# EAGLE design meter-stick-reva (EAGLE 6.5.0)
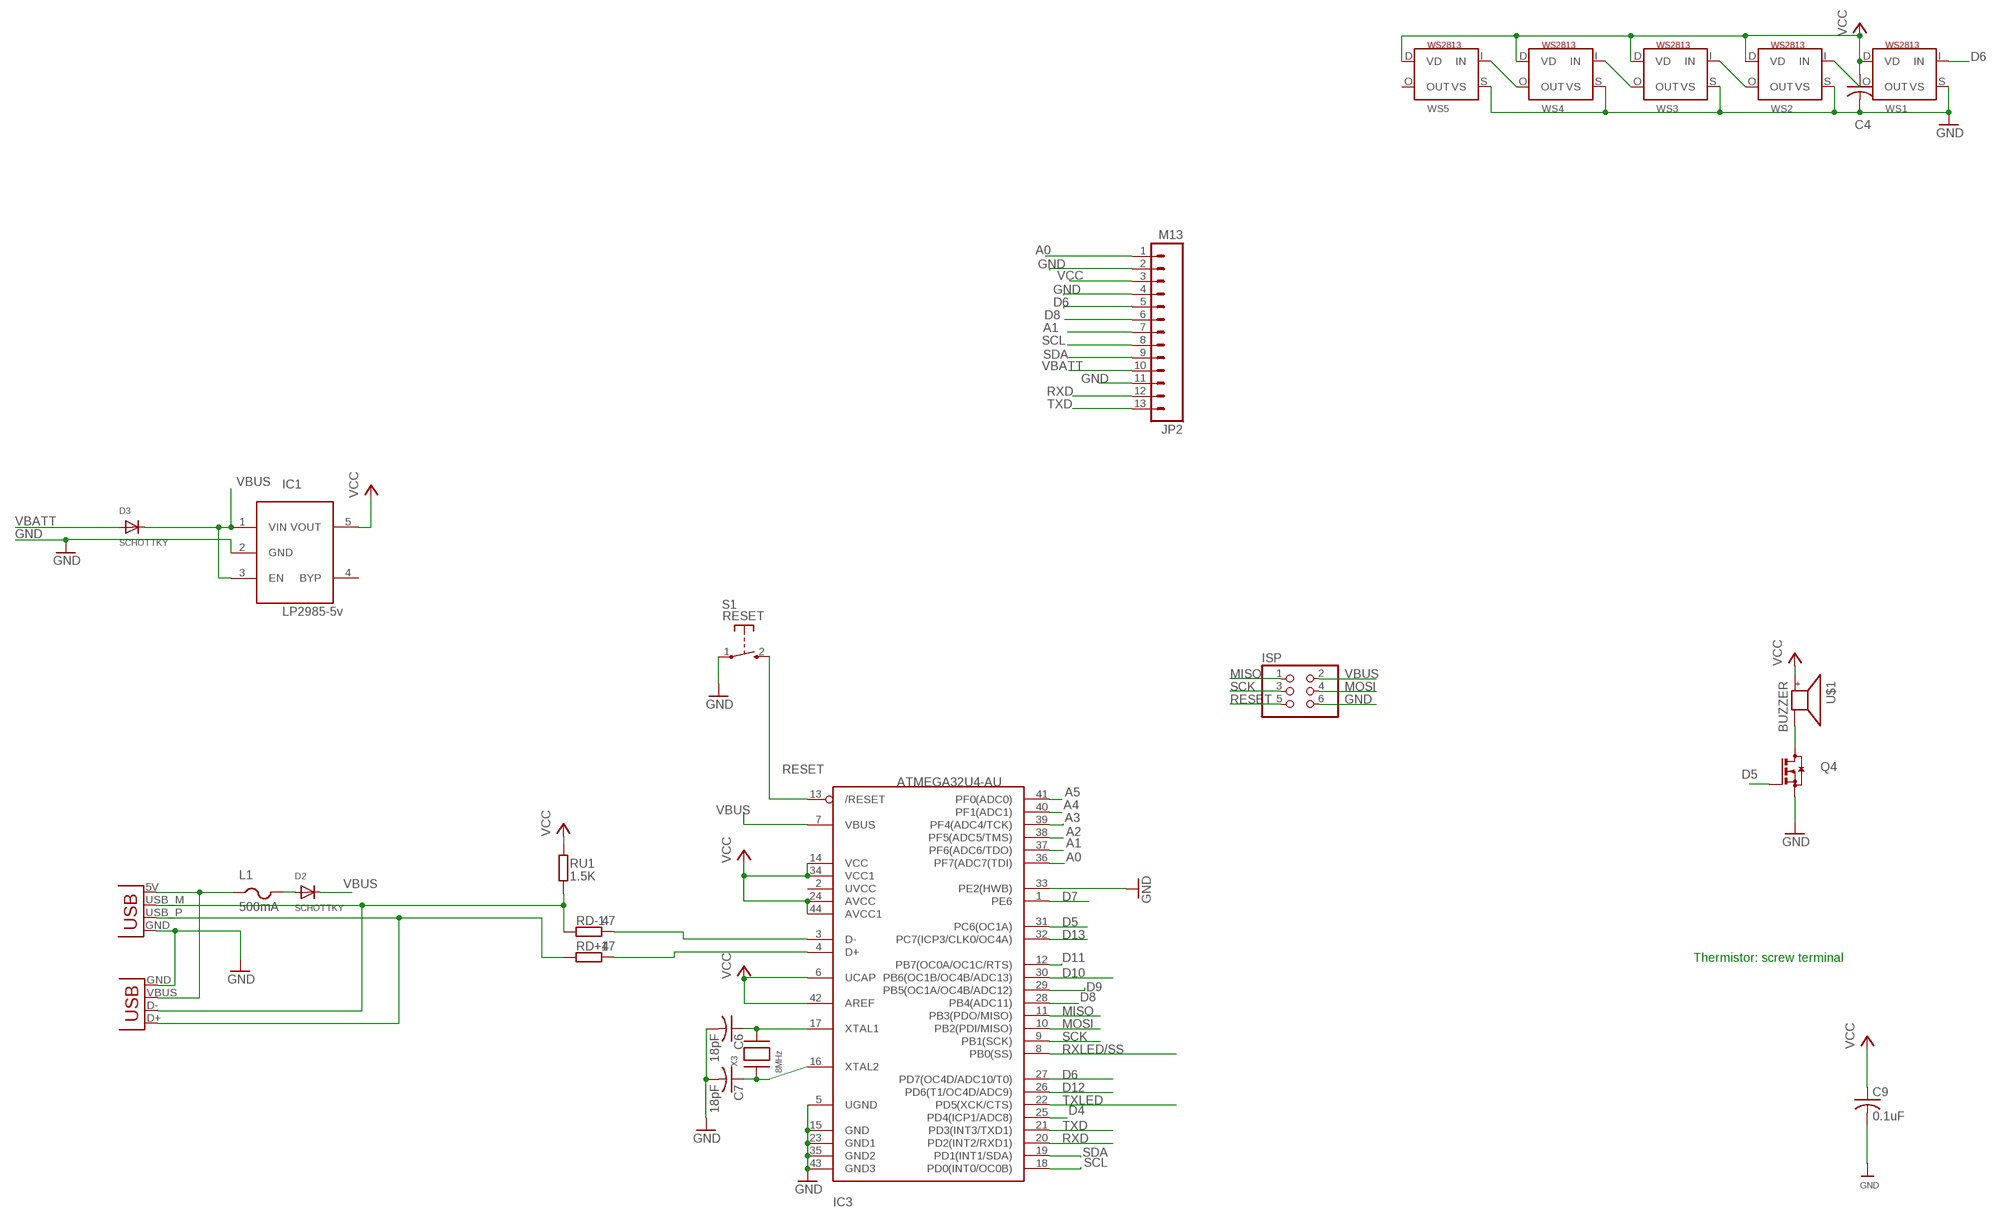
[diagram p0: schematic, sheet 1]

## Parts
C4  C-USC0805K  [C0805K]
C6  18pF  C-USC0805K  [C0805K]
C7  18pF  C-USC0805K  [C0805K]
C9  0.1uF  C-USC0805  [C0805]
D2  SCHOTTKY  DIODESOD-123  [SOD-123]
D3  SCHOTTKY  DIODESOD-123  [SOD-123]
IC1  LP2985-5v  LP298XS  [SOT23-5L]
IC3  ATMEGA32U4-AU  [TQFP44]
ISP  PINHD-2X3  [2X03]
JP2  M13  [1X13]
L1  500mA  PTCFUSE-1206  [R1206]
P1  USBPCB  [USB-A-PCB]
Q4  BSS123  [SOT23]
RD+1  47  R-EU_R0805  [R0805]
RD-1  47  R-EU_R0805  [R0805]
RU1  1.5K  R-EU_R0805  [R0805]
S1  RESET  TAC_SWITCH_2PIN  [TACTILE_SWITCH_SMD_2PIN_TINY]
U$1  BUZZER  [SMT-8585-BUZZER]
WS1  WS2813  [RGBLED5050_4]
WS2  WS2813  [RGBLED5050_4]
WS3  WS2813  [RGBLED5050_4]
WS4  WS2813  [RGBLED5050_4]
WS5  WS2813  [RGBLED5050_4]
X2  USBSMD  [USB-MINIB]
X3  8MHz  XTALNX5032  [NX5032]

## Nets
A0: IC3.36(PF7(ADC7(TDI)) JP2.1
A1: IC3.37(PF6(ADC6/TDO)) JP2.7
A2: IC3.38(PF5(ADC5/TMS))
A3: IC3.39(PF4(ADC4/TCK))
A4: IC3.40(PF1(ADC1))
A5: IC3.41(PF0(ADC0))
D4: IC3.25(PD4(ICP1/ADC8))
D5: IC3.31(PC6(OC1A)) Q4.1(G)
D6: IC3.27(PD7(OC4D/ADC10/T0)) JP2.5 WS1.I(IN)
D7: IC3.1(PE6)
D8: IC3.28(PB4(ADC11)) JP2.6
D9: IC3.29(PB5(OC1A/OC4B/ADC12))
D10: IC3.30(PB6(OC1B/OC4B/ADC13))
D11: IC3.12(PB7(OC0A/OC1C/RTS))
D12: IC3.26(PD6(T1/OC4D/ADC9))
D13: IC3.32(PC7(ICP3/CLK0/OC4A))
D-: P1.USB_M(D-) RD-1.1 RU1.1 X2.D-
GND: C4.2 C6.2 C7.2 C9.2 IC1.2(GND) IC3.5(UGND) IC3.15(GND) IC3.23(GND1) IC3.33(PE2(HWB)) IC3.35(GND2) IC3.43(GND3) ISP.6 JP2.2 JP2.4 JP2.11 P1.GND Q4.2(S) S1.1(P) WS1.S(VS) WS2.S(VS) WS3.S(VS) WS4.S(VS) WS5.S(VS) X2.GND
MISO: IC3.11(PB3(PDO/MISO)) ISP.1
MOSI: IC3.10(PB2(PDI/MISO)) ISP.4
N$1: D2.A L1.2
N$2: C7.1 IC3.16(XTAL2) X3.P$1
N$3: C6.1 IC3.17(XTAL1) X3.P$2
N$4: P1.USB_P(D+) RD+1.1 X2.D+
N$7: Q4.3(D) U$1.-
N$19: WS4.O(OUT) WS5.I(IN)
N$21: IC3.4(D+) RD+1.2
N$22: IC3.3(D-) RD-1.2
N$23: WS1.O(OUT) WS2.I(IN)
N$24: WS2.O(OUT) WS3.I(IN)
N$25: WS3.O(OUT) WS4.I(IN)
RESET: IC3.13(/RESET) ISP.5 S1.2(S)
RXD: IC3.20(PD2(INT2/RXD1)) JP2.12
RXLED/SS: IC3.8(PB0(SS))
SCK: IC3.9(PB1(SCK)) ISP.3
SCL: IC3.18(PD0(INT0/OC0B)) JP2.8
SDA: IC3.19(PD1(INT1/SDA)) JP2.9
TXD: IC3.21(PD3(INT3/TXD1)) JP2.13
TXLED: IC3.22(PD5(XCK/CTS))
VBATT: D3.A JP2.10
VBUS: D2.C D3.C IC1.1(VIN) IC1.3(EN) IC3.7(VBUS) ISP.2
VBUS1: L1.1 P1.5V(VBUS) X2.VBUS
VCC: C4.1 C9.1 IC1.5(VOUT) IC3.6(UCAP) IC3.14(VCC) IC3.24(AVCC) IC3.34(VCC1) IC3.42(AREF) IC3.44(AVCC1) JP2.3 RU1.2 U$1.+ WS1.D(VD) WS2.D(VD) WS3.D(VD) WS4.D(VD) WS5.D(VD)
Unconnected: IC1.4(BYP) IC3.2(UVCC) WS5.O(OUT)

## Notes on the sheet
- Thermistor: screw terminal

## Library data of the parts
C4 = adafruit2013:C-US: CAPACITOR, American symbol
C6 C7 C9 = adafruit:C-US: CAPACITOR, American symbol
D2 D3 = adafruit:DIODE: Diode SMADIODE - SMA Surface Mount Package 20V 1A Schottky Diode Digikey: 641-1014-6-ND DO-1N4148 - Through Hole Small Current Diode SOD-123 20V 1 A (.5mV Vf) Schottky Diode - Digikey: MBRX120TPMSCT-ND SOD-323 10V 570mA (.38mV Vf, 3ns) Schottky Diode - Digikey: ZLLS410CT-ND SOD-523 30V 30mA Schottky Diode (RB751S-40TE61) - Digikey: RB751S-40TE61CT-ND SOT23-R/W - SOT23 Package (R = Solder Paste/Reflow Ovens, W = Hand-Soldering) BAT54Film 40V 300mA - Digikey: 497-7162-1-ND
IC1 = adafruit:LP298X
IC3 = adaprog:ATMEGA32U4
ISP = pinhead:PINHD-2X3: PIN HEADER
JP2 = SparkFun-Connectors:M13: 13-pin single row .1" header
L1 = adafruit:PTCFUSE: PTC fuses, resettable thermistors
P1 = freetronics-master-v1:USB: USB Connectors USB-B-PTH is fully proven SKU : PRT-00139 USB-miniB is fully proven SKU : PRT-00587 USB-A-PCB is untested. USB-A-H is throughly reviewed, but untested. Spark Fun Electronics SKU : PRT-00437 USB-B-SMT is throughly reviewed, but untested. Needs silkscreen touching up. USB-A-S has not been used/tested USB-MB-H has not been used/tested
Q4 = transistor-small-signal:BSS123: N-CHANNEL MOS FET
RD+1 RD-1 RU1 = rcl:R-EU_: RESISTOR, European symbol
S1 = freetronics-master-v1:TAC_SWITCH_2PIN: Momentary Tactile Switch - 2 pin
U$1 = adafruit:BUZZER
WS1-WS5 = adafruit:WS2813
X2 = SparkFun:USB: USB Connectors USB-B-PTH is fully proven SKU : PRT-00139 USB-miniB is fully proven SKU : PRT-00587 USB-A-PCB is untested. USB-A-H is throughly reviewed, but untested. Spark Fun Electronics SKU : PRT-00437 USB-B-SMT is throughly reviewed, but untested. Needs silkscreen touching up. USB-A-S has not been used/tested USB-MB-H has not been used/tested
X3 = adaprog:XTAL

## Net classes
0 default: width 0.152 mm, drill 0.241 mm, clearance 0.152 mm
1 power: width 0.813 mm, clearance 0.203 mm

## Board
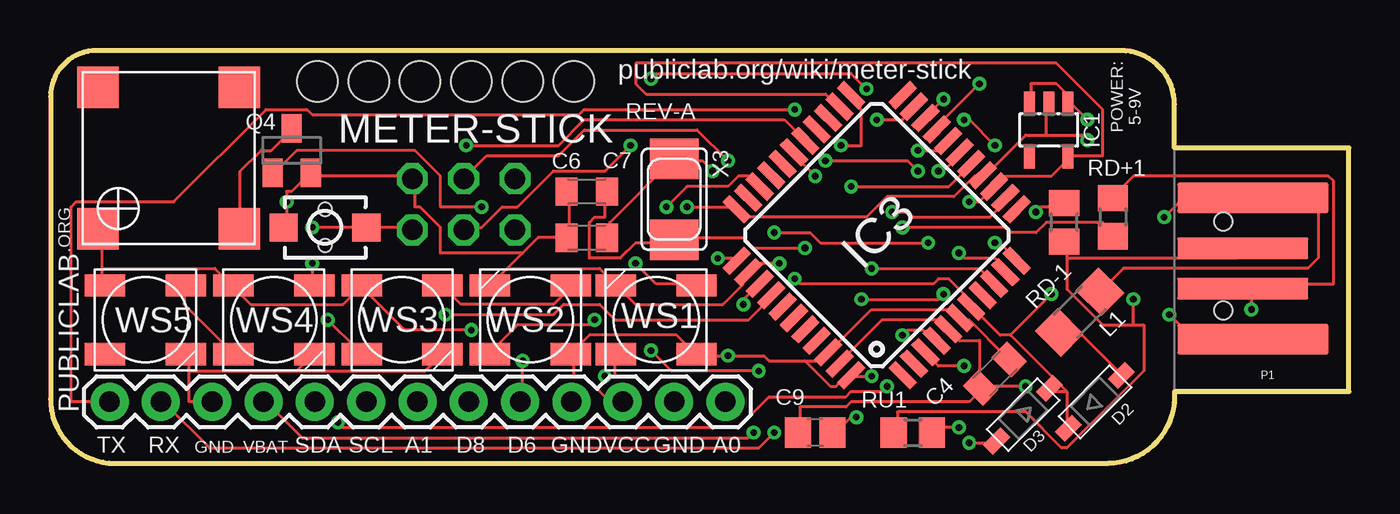
[diagram p1: board, top side]
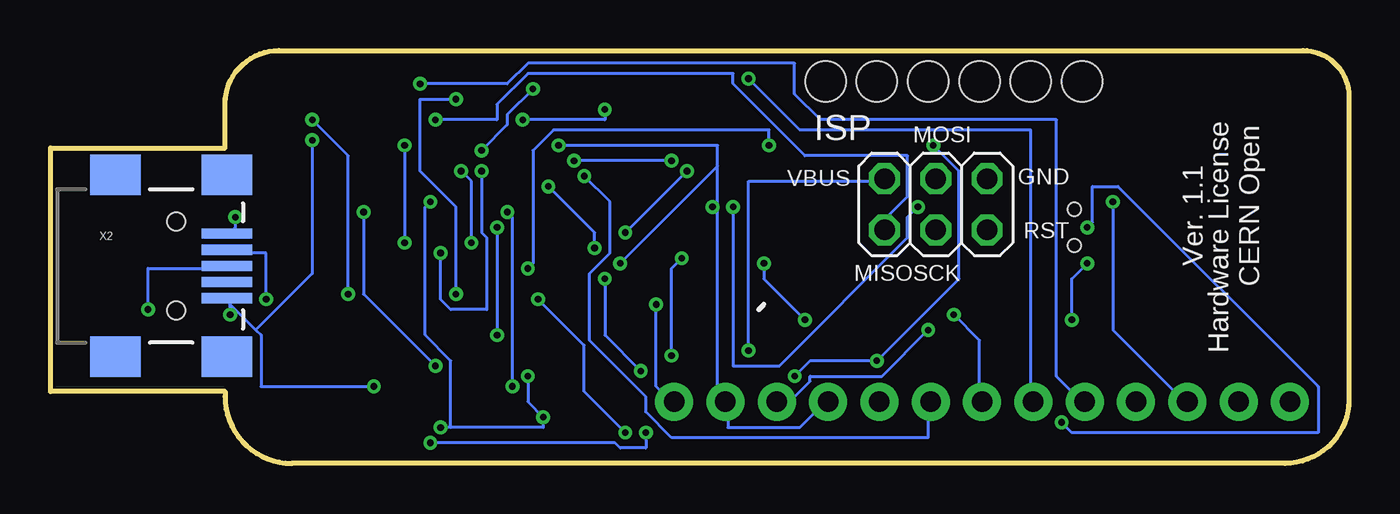
[diagram p2: board, bottom side, seen from below]

Size 64.26 x 20.45 mm. Coordinates in mm from the lower left corner, seen from the top.
Outline: 64.26,15.62 55.63,15.62 55.63,17.78 arc90 52.96,20.45 2.29,20.45 arc90 0,18.16 0,3.17 arc90 3.17,0 52.32,0 arc90 55.63,3.3 55.63,3.56 64.26,3.56 64.26,15.62
Copper layers (1*16): Top 0.0356mm / dielectric 1.5011mm / Bottom 0.0356mm
Design rules "LaenPCBOrder": minimum track width 6mil, minimum drill 13mil, track to track 6mil, track to pad 6mil, pad to pad 6mil, via to via 6mil, smd to smd 6mil, copper to edge 15mil, drill to drill 6mil, minimum pad ring 7mil, minimum via ring 7mil, stop-mask expansion 3mil, vias tented up to drill 0mil, thermal gap 10mil
Holes 2 mm at 13.21,18.92 15.75,18.92 18.29,18.92 20.83,18.92 23.37,18.92 25.91,18.92

### Footprints (pad centres in the part's own frame; a part is rotated, then mirrored left to right if it is on the bottom)
C0805K = smd 1.1 x 1.4: 1 -1,0; 2 1,0
C0805 = smd 1.3 x 1.5: 1 -0.85,0; 2 0.85,0
SOD-123 = smd 1.2 x 0.7: A 1.85,0; C -1.85,0
SOT23-5L = smd 0.55 x 1.2: 1 -0.95,-1.3; 2 0,-1.3; 3 0.95,-1.3; 4 0.95,1.3; 5 -0.95,1.3
TQFP44 = smd 1.5 x 0.5: 1 -5.8,4; 2 -5.8,3.2; 3 -5.8,2.4; 4 -5.8,1.6; 5 -5.8,0.8; 6 -5.8,0; 7 -5.8,-0.8; 8 -5.8,-1.6; 9 -5.8,-2.4; 10 -5.8,-3.2; 11 -5.8,-4; 23 5.8,-4; 24 5.8,-3.2; 25 5.8,-2.4; 26 5.8,-1.6; 27 5.8,-0.8; 28 5.8,0; 29 5.8,0.8; 30 5.8,1.6; 31 5.8,2.4; 32 5.8,3.2; 33 5.8,4 | smd 0.5 x 1.5: 12 -4,-5.8; 13 -3.2,-5.8; 14 -2.4,-5.8; 15 -1.6,-5.8; 16 -0.8,-5.8; 17 0,-5.8; 18 0.8,-5.8; 19 1.6,-5.8; 20 2.4,-5.8; 21 3.2,-5.8; 22 4,-5.8; 34 4,5.8; 35 3.2,5.8; 36 2.4,5.8; 37 1.6,5.8; 38 0.8,5.8; 39 0,5.8; 40 -0.8,5.8; 41 -1.6,5.8; 42 -2.4,5.8; 43 -3.2,5.8; 44 -4,5.8
2X03 = drill 1.016 octagon: 1 -2.54,-1.27; 2 -2.54,1.27; 3 0,-1.27; 4 0,1.27; 5 2.54,-1.27; 6 2.54,1.27
1X13 = drill 1.016 pad 1.88: 1 0,0; 2 2.54,0; 3 5.08,0; 4 7.62,0; 5 10.16,0; 6 12.7,0; 7 15.24,0; 8 17.78,0; 9 20.32,0; 10 22.86,0; 11 25.4,0; 12 27.94,0; 13 30.48,0
R1206 = smd 1.6 x 1.803: 1 -1.422,0; 2 1.422,0
USB-A-PCB = smd 7.5 x 1.5: 5V -0.2,-3.5; GND -0.2,3.5 | smd 6.5 x 1.067: USB_M 0.3,-1; USB_P 0.3,1
SOT23 = smd 1 x 1.4: 1 -0.95,-1.1; 2 0.95,-1.1; 3 0,1.1
R0805 = smd 1.3 x 1.5: 1 -0.95,0; 2 0.95,0
TACTILE_SWITCH_SMD_2PIN_TINY = smd 1.4 x 1.4: 1 -2.05,0; 2 2.05,0 | hole 0.65: 0,0.9; 0,-0.9
SMT-8585-BUZZER = smd 2.05 x 2.05: + -3.5,-3.5; - 3.5,-3.5; NC1 -3.5,3.5; NC2 3.5,3.5
RGBLED5050_4 = smd 2 x 1.1: D -2,1.7; I 2,1.7; O -2,-1.7; S 2,-1.7
USB-MINIB = smd 2.5 x 0.5: D+ 2.5,0; D- 2.5,0.8; GND 2.5,-1.6; ID 2.5,-0.8; VBUS 2.5,1.6 | smd 2.5 x 2: GND@1 -3,-4.5; GND@2 -3,4.5; GND@3 2.5,4.5; GND@4 2.5,-4.5 | hole 0.9: 0,2.2; 0,-2.2
NX5032 = smd 2 x 2.4: P$1 2,0; P$2 -2,0

### Placement (x,y rotation side)
C4  46.74,4.45 225 top
C6  26.54,11.18 180 top
C7  26.54,13.46 180 top
C9  37.85,1.52 180 top
D2  51.69,3.05 45 top
D3  48.13,2.41 225 top
IC1  49.4,16.51 180 top
IC3  40.89,11.3 135 top
ISP  20.45,12.83 0 bottom
JP2  33.4,3.05 180 top
L1  50.93,7.49 225 top
P1  59.31,9.65 180 top
Q4  11.94,15.49 0 top
RD+1  52.58,12.19 270 top
RD-1  50.16,11.94 90 top
RU1  42.67,1.52 0 top
S1  13.59,11.68 0 top
U$1  5.84,15.11 0 top
WS1  29.97,7.11 180 top
WS2  23.75,7.11 180 top
WS3  17.4,7.11 0 top
WS4  11.05,7.11 0 top
WS5  4.7,7.11 0 top
X2  58.04,9.78 0 bottom
X3  30.86,13.08 270 top

### Tracks (layer width: path | path; a pad name or v marks a point on that pad's centre or on a via)
A0  (via drill 0.33)
  Top 0.152: v34.29,7.87 34.29,8.13 35.05,8.89 IC3.36
  Bottom 0.152: v34.29,7.87 34.29,3.81 33.53,3.05 JP2.1
A1  (via drill 0.33)
  Top 0.152: v19.56,7.37 24.89,7.37 25.4,7.87 27.18,7.87 27.94,7.11 34.54,7.11 35.56,8.13 IC3.37
  Bottom 0.152: v19.56,7.37 18.29,6.1 18.29,3.05 JP2.7
D5  (via drill 0.33)
  Top 0.152: v21.34,12.7 19.3,12.7 19.3,14.22 18.03,15.49 12.19,15.49 11.18,14.48 Q4.1 | v30.48,12.7 31.5,13.72 33.53,13.72 34.04,14.22 34.54,14.22 35.05,13.72 IC3.31
  Bottom 0.152: v21.34,12.7 21.84,12.19 21.84,11.18 28.19,4.83 30.48,4.83 v30.48,12.7
D6  (via drill 0.33)
  Top 0.152: v20.57,15.75 25.15,15.75 26.42,17.02 36.32,17.02 37.34,16 IC3.27 | v23.37,5.08 23.37,3.05 JP2.5 | v27.43,4.32 27.94,4.32 27.94,5.33 WS1.I
  Bottom 0.152: v20.57,15.75 19.3,14.48 19.3,9.14 v23.37,5.08 26.67,5.08 v27.43,4.32
D8  (via drill 0.33)
  Top 0.152: v37.85,14.22 36.83,15.24 IC3.28
  Bottom 0.152: v37.85,14.22 36.58,12.95 36.58,10.41 37.59,9.4 37.59,6.1 34.8,3.3 34.8,2.54 33.53,1.27 20.83,1.27 20.83,3.05 JP2.6
D-  (via drill 0.33)
  Top 0.152: 53.59,6.86 52.07,6.86 50.29,8.64 50.29,10.16 | 53.59,6.86 54.1,6.86 54.1,4.57 50.29,0.76 50.04,0.76 48.26,2.54 41.91,2.54 41.91,1.52 RU1.1 | 50.29,10.16 50.29,10.92 RD-1.1 | 53.59,6.86 v53.59,8.13 | 50.29,10.16 58.67,10.16 58.93,10.41 P1.USB_M
  Bottom 0.152: v53.59,8.13 53.59,10.41 55.37,10.41 X2.D-
GND  (via drill 0.33)
  Top 0.152: 6.86,4.57 6.86,3.05 JP2.11 | 6.86,4.57 6.86,5.33 WS5.S | 12.19,4.57 12.95,5.33 WS4.S | 6.86,4.57 12.19,4.57 | 12.19,4.57 18.54,4.57 19.3,5.33 WS3.S | S1.1 11.68,11.68 v11.68,12.95 11.68,13.46 11.94,13.46 12.7,14.22 Q4.2 12.95,14.22 17.78,14.22 ISP.6 18.03,13.97 18.03,12.7 18.29,12.7 19.3,11.68 19.3,10.41 23.37,10.41 | C7.2 25.65,13.46 25.65,11.18 C6.2 24.13,11.18 23.37,10.41 | 23.37,10.41 22.61,9.65 | 22.61,9.65 21.84,8.89 WS2.S | 22.61,9.65 27.18,9.65 27.94,8.89 WS1.S 28.19,8.64 28.96,7.87 33.27,7.87 34.29,8.89 34.29,9.4 IC3.35 34.54,9.65 34.8,9.91 v36.07,9.91 | C4.2 45.97,3.81 45.97,6.1 44.96,6.1 44.45,6.6 IC3.5 44.2,6.86 43.94,7.11 41.15,7.11 39.12,5.08 IC3.43 | C9.2 37.08,1.52 37.08,2.79 39.37,2.79 39.62,3.05 45.47,3.05 45.97,3.56 C4.2 | v55.37,7.37 56.39,6.35 59.44,6.35 P1.GND | v48.26,3.81 46.23,3.81 C4.2 | 49.28,16.26 49.28,17.78 IC1.2 | 49.28,16.26 48.26,16.26 46.48,14.48 46.23,14.48 IC3.15 45.97,14.22 45.72,14.22 44.7,13.21 41.4,13.21 40.39,12.19 34.29,12.19 34.04,12.45 IC3.33 33.78,12.7 v31.5,12.7 | v39.12,15.75 40.13,15.75 40.13,17.53 39.62,18.03 IC3.23 | v51.31,16 51.05,16.26 49.28,16.26
  Bottom 0.152: v11.68,12.95 11.68,6.6 8.13,3.05 JP2.11 | v55.37,7.37 55.37,7.87 | 55.37,7.87 55.37,8.13 X2.GND | v48.26,3.81 53.85,3.81 53.85,6.35 54.1,6.6 | 55.37,7.87 54.1,6.6 | v39.12,15.75 31.24,15.75 31.24,14.73 | 31.24,12.7 31.24,3.3 30.99,3.05 JP2.2 30.73,3.05 30.73,1.78 27.18,1.78 25.91,3.05 JP2.4 | 31.24,12.7 31.24,14.73 | 31.24,12.7 v31.5,12.7 | 54.1,6.6 51.31,9.4 v51.31,16 | 31.24,14.73 v36.07,9.91
MISO  (via drill 0.33)
  Top 0.152: v46.74,10.92 46.99,10.92 47.75,10.16 IC3.11 | v46.74,15.75 45.47,17.02 v45.21,17.02
  Bottom 0.152: v46.74,15.75 v46.74,10.92 | v45.21,17.02 42.16,17.02 42.16,17.78 40.64,19.3 30.48,19.3 30.48,18.8 26.92,15.24 21.84,15.24 21.84,13.21 22.86,12.19 22.86,11.68 ISP.1
MOSI  (via drill 0.33)
  Top 0.152: v44.96,10.41 45.21,10.16 46.74,10.16 47.24,9.65 IC3.10 | v42.93,14.48 42.42,14.99 v38.35,14.99 | v33.53,14.99 32,16.51 26.42,16.51 25.15,15.24 21.59,15.24 ISP.4
  Bottom 0.152: v44.96,10.41 44.96,8.13 44.45,7.62 42.67,7.62 42.67,11.18 42.93,11.43 v42.93,14.48 | v33.53,14.99 v38.35,14.99
N$1
  Top 0.152: D2.A 52.83,4.57 51.05,6.35 50.04,6.35 L1.2
N$2  (via drill 0.33)
  Top 0.152: C7.1 27.43,13.46 27.43,12.19 26.92,12.19 26.67,11.94 26.67,10.16 28.19,10.16 28.96,10.92 30.73,10.92 X3.P$1 30.99,11.18 34.29,11.18 34.8,10.67 v37.34,10.67 | v39.62,13.72 44.45,13.72 45.47,14.73 IC3.16
  Bottom 0.152: v39.62,13.72 37.34,11.43 v37.34,10.67
N$3  (via drill 0.33)
  Top 0.152: C6.1 27.69,11.18 27.69,11.94 30.73,14.99 X3.P$2 30.99,14.99 32.26,14.99 v32.77,14.48 | v43.94,14.48 44.2,14.48 44.96,15.24 IC3.17 | v43.43,10.92 38.1,10.92 37.59,11.43 v35.81,11.43
  Bottom 0.152: v43.94,14.48 43.43,13.97 v43.43,10.92 | v32.77,14.48 v35.81,11.43
N$4  (via drill 0.33)
  Top 0.152: RD+1.1 52.58,13.21 53.59,14.22 63.25,14.22 63.5,13.97 63.5,8.89 59.18,8.89 P1.USB_P 59.18,8.64 59.44,8.64 v59.44,7.62
  Bottom 0.152: v59.44,7.62 59.44,9.65 55.63,9.65 X2.D+
N$7
  Top 0.152: Q4.3 11.94,16.51 10.92,15.49 10.41,15.49 9.4,14.48 9.4,11.68 U$1.-
N$19
  Top 0.152: WS4.O 8.89,5.59 6.6,7.87 6.6,8.64 WS5.I
N$21  (via drill 0.33)
  Top 0.152: v42.16,6.35 42.42,6.6 43.18,6.6 43.69,6.1 IC3.4 | v42.16,11.68 47.24,11.68 47.5,11.43 48.77,11.43 49.28,11.94 52.07,11.94 52.58,11.43 RD+1.2
  Bottom 0.152: v42.16,11.68 v42.16,6.35
N$22  (via drill 0.33)
  Top 0.152: v45.21,4.83 43.94,4.83 43.43,5.33 IC3.3 | v48.77,12.45 49.02,12.7 50.04,12.7 RD-1.2
  Bottom 0.152: v45.21,4.83 48.77,8.38 v48.77,12.45
N$23  (via drill 0.33)
  Top 0.152: v26.92,7.11 26.67,6.86 23.11,6.86 21.84,5.59 WS2.I | v28.96,9.91 29.97,8.89 31.75,8.89 WS1.O
  Bottom 0.152: v26.92,7.11 28.96,9.14 v28.96,9.91
N$24
  Top 0.152: WS3.I 19.56,8.64 20.32,7.87 24.89,7.87 25.65,8.64 WS2.O
N$25  (via drill 0.33)
  Top 0.152: v12.95,9.91 12.95,8.89 WS4.I | v13.72,7.11 15.24,5.59 WS3.O
  Bottom 0.152: v12.95,9.91 13.72,9.14 v13.72,7.11
RESET  (via drill 0.33)
  Top 0.152: ISP.5 17.78,11.68 S1.2 v12.95,11.68 | v41.66,12.45 42.42,12.45 42.67,12.19 46.48,12.19 47.24,12.95 IC3.13 | v41.4,3.81 41.15,3.56 39.62,3.56 39.37,3.3 35.56,3.3 34.04,1.78 14.48,1.78 v14.22,2.03
  Bottom 0.152: v41.66,12.45 41.4,12.19 v41.4,3.81 | v14.22,2.03 13.72,1.52 1.52,1.52 1.52,3.81 11.43,13.72 12.7,13.72 12.7,11.94 v12.95,11.68
RXD  (via drill 0.33)
  Top 0.152: v44.2,18.03 43.43,17.27 IC3.20 | v44.2,8.38 43.94,8.13 v40.13,8.13 | v35.81,1.52 35.05,0.76 7.87,0.76 5.59,3.05 JP2.12
  Bottom 0.152: v44.2,18.03 45.97,18.03 45.97,14.48 44.2,12.7 v44.2,8.38 | v40.13,8.13 37.85,5.84 37.85,3.56 v35.81,1.52
SCK  (via drill 0.33)
  Top 0.152: v40.64,9.65 45.97,9.65 46.48,9.14 IC3.9 | v28.7,15.75 27.43,14.48 24.89,14.48 23.11,12.7 22.35,12.7 21.34,11.68 20.57,11.68 ISP.3
  Bottom 0.152: v40.64,9.65 40.39,9.91 40.39,15.49 39.37,16.51 28.7,16.51 v28.7,15.75
SCL  (via drill 0.33)
  Top 0.152: v42.93,15.49 43.94,15.49 44.2,15.75 IC3.18 | v40.39,18.54 39.62,19.3 29.97,19.3 v29.72,19.05
  Bottom 0.152: v42.93,15.49 41.66,16.76 41.66,17.27 v40.39,18.54 | v29.72,19.05 27.18,16.51 15.75,16.51 15.75,3.05 JP2.8
SDA  (via drill 0.33)
  Top 0.152: v45.97,18.8 43.94,16.76 IC3.19
  Bottom 0.152: v45.97,18.8 41.66,18.8 40.64,19.81 27.43,19.81 27.43,18.29 26.16,17.02 14.48,17.02 14.48,4.32 13.21,3.05 JP2.9
TXD  (via drill 0.33)
  Top 0.152: v40.89,17.02 42.16,17.02 42.67,17.53 IC3.21 | v36.83,17.53 26.42,17.53 26.16,17.27 12.95,17.27 12.7,17.53 10.67,17.53 6.1,12.95 1.27,12.95 1.02,12.7 1.02,3.05 JP2.13
  Bottom 0.152: v40.89,17.02 36.83,17.02 v36.83,17.53
VBATT  (via drill 0.33)
  Top 0.152: v45.47,1.02 46.74,1.02 D3.A | v34.8,1.52 34.54,1.27 12.45,1.27 10.67,3.05 JP2.10
  Bottom 0.152: v45.47,1.02 36.32,1.02 36.07,0.76 34.8,0.76 v34.8,1.52
VBUS  (via drill 0.33)
  Top 0.152: IC1.3 48.51,18.03 48.51,18.8 49.78,18.8 50.55,18.03 IC1.1 50.55,17.78 v51.31,17.02 | 50.29,3.56 50.29,1.78 D2.C | 50.29,3.56 49.53,3.56 D3.C | 47.5,6.35 46.99,6.35 45.72,7.62 IC3.7 45.72,7.87 44.45,9.14 43.94,9.14 43.69,8.89 37.08,8.89 v36.83,9.14 | 50.29,3.56 47.5,6.35 | 47.5,6.35 v49.53,8.38 | v29.72,5.59 30.73,4.57 v35.05,4.57
  Bottom 0.152: v51.31,17.02 49.53,15.24 v49.53,8.38 | v29.72,5.59 29.72,13.97 23.11,13.97 ISP.2 | v35.05,4.57 36.83,6.35 v36.83,9.14
VBUS1  (via drill 0.33)
  Top 0.152: L1.1 53.09,9.65 62.23,9.65 62.74,10.16 62.74,12.95 59.69,12.95 P1.5V 59.44,12.95 55.88,12.95 v55.12,12.19
  Bottom 0.152: v55.12,12.19 55.12,11.68 55.37,11.43 X2.VBUS
VCC  (via drill 0.33)
  Top 0.152: IC3.24 38.86,17.78 38.35,18.29 29.46,18.29 28.96,18.8 28.96,19.81 49.78,19.81 52.07,17.53 52.07,15.24 50.55,15.24 IC1.5 50.29,14.99 49.53,14.22 47.24,14.22 46.74,13.72 IC3.14 46.48,13.46 45.97,12.95 v45.47,12.95 | 2.54,9.65 2.54,11.43 U$1.+ | 2.54,9.65 2.54,8.89 WS5.D | 2.54,9.65 8.13,9.65 8.89,8.89 WS4.D 9.14,8.64 9.91,7.87 14.48,7.87 15.24,8.64 WS3.D 15.49,8.64 17.53,6.6 v20.83,6.6 | JP2.3 27.69,3.05 26.42,4.32 25.91,4.32 25.91,5.33 WS2.D 25.91,5.59 26.67,6.35 30.99,6.35 31.75,5.59 WS1.D 32,5.33 v33.53,5.33 35.31,5.33 35.56,5.08 37.34,5.08 | v39.88,2.29 39.62,2.29 38.86,1.52 C9.1 | v40.64,4.32 39.62,4.32 IC3.44 39.37,4.32 38.86,3.81 38.61,3.81 37.34,5.08 | v44.96,1.78 43.94,1.78 43.69,1.52 RU1.2 | C4.1 47.24,5.33 45.47,7.11 45.21,7.11 IC3.6 44.96,7.37 44.7,7.62 40.64,7.62 38.61,5.59 IC3.42 38.35,5.33 38.1,5.08 37.34,5.08 | v33.02,10.16 33.78,10.16 IC3.34
  Bottom 0.152: v40.64,4.32 40.64,3.05 v39.88,2.29 39.88,1.78 44.45,1.78 | 44.45,1.78 v44.96,1.78 | v33.02,10.16 33.53,9.65 v33.53,5.33 | v20.83,6.6 23.11,4.32 26.67,4.32 26.67,4.06 27.69,3.05 JP2.3 | v45.47,12.95 45.72,12.7 45.72,6.35 44.45,5.08 44.45,1.78

### Text on the board
tNames: publiclab.org/wiki/meter-stick | REV-A | 5-9V | METER-STICK | POWER: | .ORG | PUBLICLAB | TX | RX | GND | VBAT | SDA | SCL | A1 | D8 | D6 | GND | VCC | GND | A0
bNames: MOSI | GND | VBUS | RST | Ver. 1.1 | CERN Open | SCK | MISO | Hardware License